# Altium schematic sheet AD4111_2.SchDoc
size A3; SheetNumber: 2; SheetTotal: 3
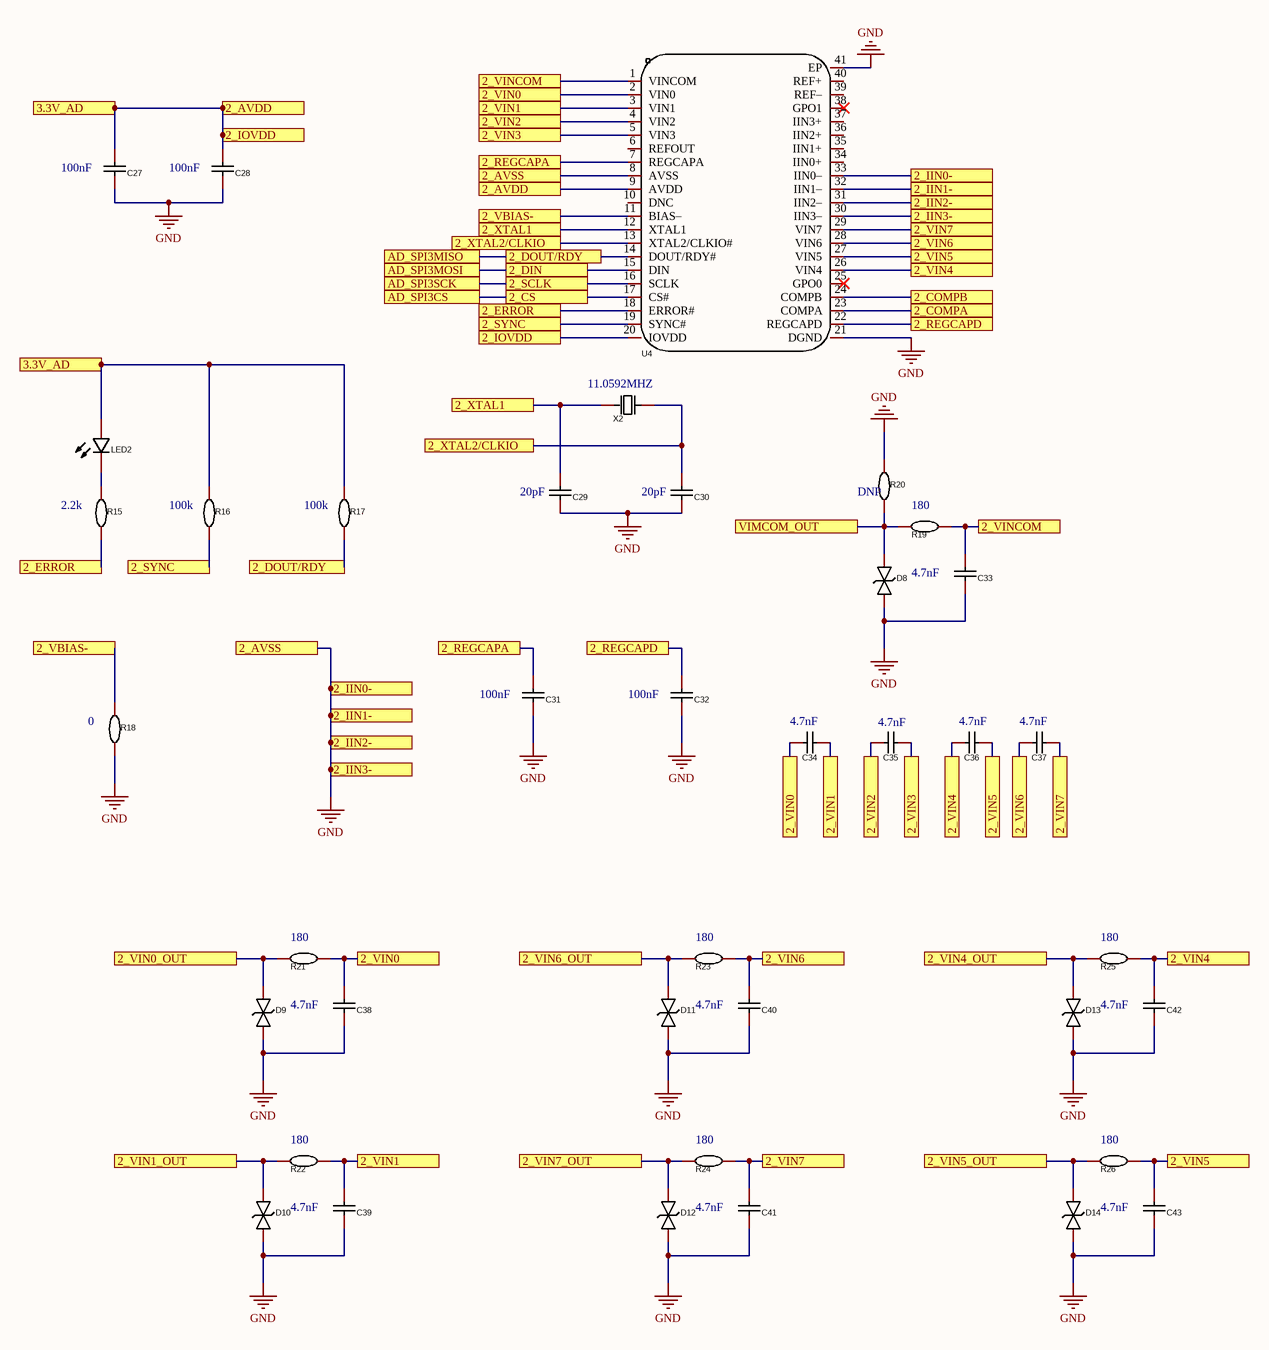
[diagram p0: AD4111_2.SchDoc]

## Parts
C27  100nF  [C0603]
C28  100nF  [C0603]
C29  20pF  [C0603]
C30  20pF  [C0603]
C31  100nF  [C0603]
C32  100nF  [C0603]
C33  4.7nF  [C0603]
C34  4.7nF  [C0603]
C35  4.7nF  [C0603]
C36  4.7nF  [C0603]
C37  4.7nF  [C0603]
C38  4.7nF  [C0603]
C39  4.7nF  [C0603]
C40  4.7nF  [C0603]
C41  4.7nF  [C0603]
C42  4.7nF  [C0603]
C43  4.7nF  [C0603]
D8  SMAJ33CA_C908829  [SMA_L4.4-W2.8-LS5.1-BI]  (value not drawn)
D9  SMAJ33CA_C908829  [SMA_L4.4-W2.8-LS5.1-BI]  (value not drawn)
D10  SMAJ33CA_C908829  [SMA_L4.4-W2.8-LS5.1-BI]  (value not drawn)
D11  SMAJ33CA_C908829  [SMA_L4.4-W2.8-LS5.1-BI]  (value not drawn)
D12  SMAJ33CA_C908829  [SMA_L4.4-W2.8-LS5.1-BI]  (value not drawn)
D13  SMAJ33CA_C908829  [SMA_L4.4-W2.8-LS5.1-BI]  (value not drawn)
D14  SMAJ33CA_C908829  [SMA_L4.4-W2.8-LS5.1-BI]  (value not drawn)
LED2  NCD0603R1_C84263  [LED0603-RD_RED]  (value not drawn)
R15  2.2k  [R0603]
R16  100k  [R0603]
R17  100k  [R0603]
R18  0  [R0603]
R19  180  [R0603]
R20  DNP  [R0603]
R21  180  [R0603]
R22  180  [R0603]
R23  180  [R0603]
R24  180  [R0603]
R25  180  [R0603]
R26  180  [R0603]
U4  AD4111BCPZ  [LFCSP-40_L6.0-W6.0-P0.50-TL-EP4.6]  (value not drawn)
X2  11.0592MHZ  [OSC-SMD_L5.0-W3.2]

## Ports
2_AVDD, 2_AVSS, 2_COMPA, 2_COMPB, 2_CS, 2_DIN, 2_DOUT/RDY, 2_ERROR, 2_IIN0-, 2_IIN1-, 2_IIN2-, 2_IIN3-, 2_IOVDD, 2_REGCAPA, 2_REGCAPD, 2_SCLK, 2_SYNC, 2_VBIAS-, 2_VIN0, 2_VIN0_OUT, 2_VIN1, 2_VIN1_OUT, 2_VIN2, 2_VIN3, 2_VIN4, 2_VIN4_OUT, 2_VIN5, 2_VIN5_OUT, 2_VIN6, 2_VIN6_OUT, 2_VIN7, 2_VIN7_OUT, 2_VINCOM, 2_XTAL1, 2_XTAL2/CLKIO, 3.3V_AD, AD_SPI3CS, AD_SPI3MISO, AD_SPI3MOSI, AD_SPI3SCK, VIMCOM_OUT

## Nets
GND: C27.1 C28.1 C29.1 C30.1 C31.1 C32.1 C33.1 C38.1 C39.1 C40.1 C41.1 C42.1 C43.1 D8.2 D9.2 D10.2 D11.2 D12.2 D13.2 D14.2 R18.1 R20.2 U4.8(AVSS) U4.21(DGND) U4.30(IIN3–) U4.31(IIN2–) U4.32(IIN1–) U4.33(IIN0–) U4.41(EP) ; port 2_AVSS, port 2_IIN0-, port 2_IIN1-, port 2_IIN2-, port 2_IIN3-
2_AVDD: C27.2 C28.2 LED2.2(A) R16.2 R17.2 U4.9(AVDD) U4.20(IOVDD) ; port 2_AVDD, port 2_IOVDD, port 3.3V_AD
2_COMPA: U4.23(COMPA) ; port 2_COMPA
2_COMPB: U4.24(COMPB) ; port 2_COMPB
2_CS: U4.17(CS#) ; port AD_SPI3CS, port 2_CS
2_DIN: U4.15(DIN) ; port AD_SPI3MOSI, port 2_DIN
2_DOUT/RDY: R17.1 U4.14(DOUT/RDY#) ; port AD_SPI3MISO, port 2_DOUT/RDY
2_ERROR: R15.1 U4.18(ERROR#) ; port 2_ERROR
2_REGCAPA: C31.2 U4.7(REGCAPA) ; port 2_REGCAPA
2_REGCAPD: C32.2 U4.22(REGCAPD) ; port 2_REGCAPD
2_SCLK: U4.16(SCLK) ; port AD_SPI3SCK, port 2_SCLK
2_SYNC: R16.1 U4.19(SYNC#) ; port 2_SYNC
2_VBIAS-: R18.2 U4.11(BIAS–) ; port 2_VBIAS-
2_VIN0: C34.1 C38.2 R21.2 U4.2(VIN0) ; port 2_VIN0
2_VIN0_OUT: D9.1 R21.1 ; port 2_VIN0_OUT
2_VIN1: C34.2 C39.2 R22.2 U4.3(VIN1) ; port 2_VIN1
2_VIN1_OUT: D10.1 R22.1 ; port 2_VIN1_OUT
2_VIN2: C35.1 U4.4(VIN2) ; port 2_VIN2
2_VIN3: C35.2 U4.5(VIN3) ; port 2_VIN3
2_VIN4: C36.1 C42.2 R25.2 U4.26(VIN4) ; port 2_VIN4
2_VIN4_OUT: D13.1 R25.1 ; port 2_VIN4_OUT
2_VIN5: C36.2 C43.2 R26.2 U4.27(VIN5) ; port 2_VIN5
2_VIN5_OUT: D14.1 R26.1 ; port 2_VIN5_OUT
2_VIN6: C37.1 C40.2 R23.2 U4.28(VIN6) ; port 2_VIN6
2_VIN6_OUT: D11.1 R23.1 ; port 2_VIN6_OUT
2_VIN7: C37.2 C41.2 R24.2 U4.29(VIN7) ; port 2_VIN7
2_VIN7_OUT: D12.1 R24.1 ; port 2_VIN7_OUT
2_VINCOM: C33.2 R19.2 U4.1(VINCOM) ; port 2_VINCOM
2_XTAL1: C29.2 U4.12(XTAL1) X2.1(OSC1) ; port 2_XTAL1
2_XTAL2/CLKIO: C30.2 U4.13(XTAL2/CLKIO#) X2.2(OSC2) ; port 2_XTAL2/CLKIO
VIMCOM_OUT: D8.1 R19.1 R20.1 ; port VIMCOM_OUT
NetLED2_1: LED2.1(K) R15.2

Not connected (* = marked no-connect by the designer): U4 6(REFOUT) 10(DNC) 25(GPO0)* 34(IIN0+) 35(IIN1+) 36(IIN2+) 37(IIN3+) 38(GPO1)* 39(REF–) 40(REF+)

## Library data of the parts
C27 C28 C31 C32 = 0603B104K500NT: 0603电容; Manufacturer: FH(风华); Add into BOM: yes; Tolerance: ±10%; Voltage Rated: 50V; Temperature Coefficient: X7R; Name: 100nF; Symbol: 0603B104K500NT; Device: 0603B104K500NT; LCSC Part Name: 100nF ±10% 50V; Supplier Part: C30926; Manufacturer Part: 0603B104K500NT; Supplier Footprint: 0603; JLCPCB Part Class: Extended Part; Datasheet: https://atta.szlcsc.com/upload/public/pdf/source/20170923/C30926_1506149436298988724.pdf; Supplier: LCSC; Convert to PCB: yes; Value: 100nF
C29 C30 C33-C43 = 0603B104K500NT: 0603电容; Manufacturer: FH(风华); Name: 100nF; Add into BOM: yes; Value: 100nF; Tolerance: ±10%; Voltage Rated: 50V; Temperature Coefficient: X7R; Symbol: 0603B104K500NT; Device: 0603B104K500NT; LCSC Part Name: 100nF ±10% 50V; Supplier Part: C30926; Manufacturer Part: 0603B104K500NT; Supplier Footprint: 0603; JLCPCB Part Class: Extended Part; Datasheet: https://atta.szlcsc.com/upload/public/pdf/source/20170923/C30926_1506149436298988724.pdf; Supplier: LCSC; Convert to PCB: yes
D8-D14 = SMAJ33CA_C908829: SMAJ33CA; Manufacturer: GOODWORK(固得沃克); Add into BOM: yes; Reverse Stand-Off Voltage (Vrwm): 33V; Maximum Clamping Voltage: 53.3V; Peak Pulse Current (Ipp)@10/1000us: 7.5A; Breakdown Voltage: 36.7V; Reverse Leakage Current (Ir): 5uA; Name: SMAJ33CA; Symbol: SMAJ33CA_C908829; Device: SMAJ33CA_C908829; LCSC Part Name: 双向TVS 33V截止 7.5A峰值脉冲; Supplier Part: C908829; Manufacturer Part: SMAJ33CA; Supplier Footprint: SMA(DO-214AC); JLCPCB Part Class: Extended Part; Datasheet: https://atta.szlcsc.com/upload/public/pdf/source/20201231/C908757_5436EAF671B686EFC2F0DD2098F0ED89.pdf; Supplier: LCSC; Convert to PCB: yes
LED2 = NCD0603R1_C84263: LED; Manufacturer: 国星光电; Symbol: FC-DA1608HRK-620D; Add into BOM: yes; Emitted Color: 红灯; Name: NCD0603R1; Device: NCD0603R1_C84263; LCSC Part Name: 红灯; Supplier Part: C84263; Manufacturer Part: NCD0603R1; Supplier Footprint: 0603; JLCPCB Part Class: Extended Part; Datasheet: https://atta.szlcsc.com/upload/public/pdf/source/20200820/C84263_DABC6A75E58F576973B407FDBA283D60.pdf; Supplier: LCSC; Convert to PCB: yes
R15-R26 = 0603WAF1002T5E: 0603电阻; Manufacturer: UNI-ROYAL(厚声); Name: 10kΩ; Add into BOM: yes; Value: 10kΩ; Tolerance: ±1%; Power(Watts): 100mW; Temperature Coefficient: ±100ppm/℃; Overload Voltage (Max): 75V; Symbol: 0603WAF1002T5E; Device: 0603WAF1002T5E; LCSC Part Name: 厚膜电阻 10kΩ ±1% 100mW; Supplier Part: C25804; Manufacturer Part: 0603WAF1002T5E; Supplier Footprint: 0603; JLCPCB Part Class: Basic Part; Datasheet: https://atta.szlcsc.com/upload/public/pdf/source/20200306/C422600_1E6D84923E4A46A82E41ADD87F860B5C.pdf; Supplier: LCSC; Convert to PCB: yes; Type: 厚膜电阻; Operating Temperature Range: -55℃~+155℃
U4 = AD4111BCPZ: Manufacturer: ADI(亚德诺); Add into BOM: yes; Interface: 串行；SPI; differential input: 是; number of channels: 4；8; sampling frequency: 6.2kHz; resolution: 24位; Supply Voltage: 2V~5.5V; Name: AD4111BCPZ; Symbol: AD4111BCPZ; Device: AD4111BCPZ; LCSC Part Name: AD4111BCPZ; Supplier Part: C649166; Manufacturer Part: AD4111BCPZ; Supplier Footprint: LFCSP-40; JLCPCB Part Class: Extended Part; Datasheet: https://atta.szlcsc.com/upload/public/pdf/source/20220519/010EE3C44EFBAA26D33F75A00EF652F8.pdf; Supplier: LCSC; Convert to PCB: yes; Operating Temperature: -40℃~+105℃
X2 = X5032110592MSB2GI: 11.0592MHZ晶振; Manufacturer: YXC(扬兴晶振); Add into BOM: yes; Crystal Type: 贴片无源晶振; Load Capacitance: 20pF; Frequency Tolerance: ±10ppm; Frequency Stability: ±50ppm; Name: 11.0592MHz; Symbol: X5032110592MSB2GI; Device: X5032110592MSB2GI; LCSC Part Name: 11.0592MHz ±10ppm 20pF YSX530GA; Supplier Part: C112574; Manufacturer Part: X5032110592MSB2GI; Supplier Footprint: SMD5032-2P; JLCPCB Part Class: Basic Part; Datasheet: https://atta.szlcsc.com/upload/public/pdf/source/20210329/C112559_847D3CACBA33ACCEB57DEA3AEBB187A1.pdf; Supplier: LCSC; Convert to PCB: yes; Value: 11.0592MHz; Operating Temperature: -40℃~+85℃